# EAGLE design ZXSC380FHTA (EAGLE 8.4.3)
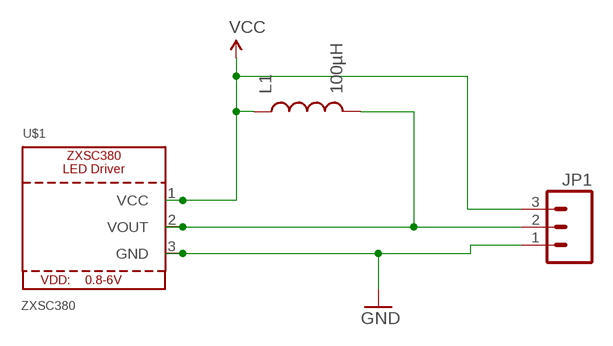
[diagram p0: schematic, sheet 1]

## Parts
JP1  M03PTH  [1X03]
L1  100µH  INDUCTOR0805  [0805]
U$1  ZXSC380  [SOT-23]

## Nets
GND: JP1.1 U$1.3(GND)
VCC: JP1.3 L1.1 U$1.1(VCC)
VOUT: JP1.2 L1.2 U$1.2(VOUT)

## Library data of the parts
JP1 = SparkFun-Connectors:M03: Header 3 Standard 3-pin 0.1" header. Use with straight break away headers (SKU : PRT-00116), right angle break away headers (PRT-00553), swiss pins (PRT-00743), machine pins (PRT-00117), and female headers (PRT-00115). Molex polarized connector foot print use with SKU : PRT-08232 with associated crimp pins and housings.
L1 = SparkFun-Passives:INDUCTOR: Inductors Basic Inductor/Choke - 0603 and 1206. Footprints are not proven and vary greatly between part numbers. INDUCTOR POWER 3.3UH 4.0A SMD 0.197" L x 0.197" W x 0.177" H (5.00mm x 5.00mm x 4.50mm)
U$1 = Takaitra:ZXSC380: Single or multi cell LED driver solution

## Board
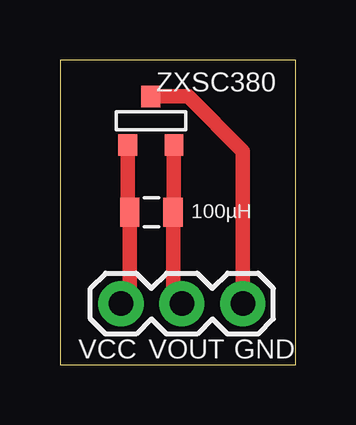
[diagram p1: board, top side]

Size 9.83 x 12.69 mm. Coordinates in mm from the lower left corner, seen from the top.
Outline: 0,0 9.83,0 9.83,12.69 0,12.69 0,0
Copper layers (1*16): Top 0.035mm / dielectric 1.5mm / Bottom 0.035mm
Design rules "default": minimum track width 6mil, minimum drill 0.35mm, track to track 6mil, track to pad 6mil, pad to pad 6mil, via to via 6mil, smd to smd 6mil, copper to edge 40mil, drill to drill 6mil, minimum pad ring 10mil, minimum via ring 8mil, stop-mask expansion 4mil, vias tented up to drill 0mil, thermal gap 10mil

### Footprints (pad centres in the part's own frame; a part is rotated, then mirrored left to right if it is on the bottom)
1X03 = drill 1.016 pad 1.88: 1 0,0; 2 2.54,0; 3 5.08,0
0805 = smd 0.8 x 1.2: 1 -0.9,0; 2 0.9,0
SOT-23 = smd 0.787 x 0.889: 1 0.991,1.016; 2 -0.94,1.016; 3 0.025,-1.016

### Placement (x,y rotation side)
JP1  7.62,2.54 180 top
L1  3.81,6.35 0 top
U$1  3.81,10.16 180 top

### Tracks (layer width: path | path; a pad name or v marks a point on that pad's centre or on a via)
GND
  Top 0.61: U$1.3 5.33,11.18 7.62,8.89 JP1.1
VCC
  Top 0.61: JP1.3 2.91,2.91 L1.1 2.82,6.44 U$1.1
VOUT
  Top 0.61: JP1.2 4.71,2.91 L1.2 4.75,6.39 U$1.2

### Text on the board
tNames: VCC | VOUT | GND